# Altium schematic sheet WAB_1_1_top_level.SchDoc: FMC Top Sheet
size A2; DocumentNumber: 1; SheetNumber: 1; SheetTotal: 2
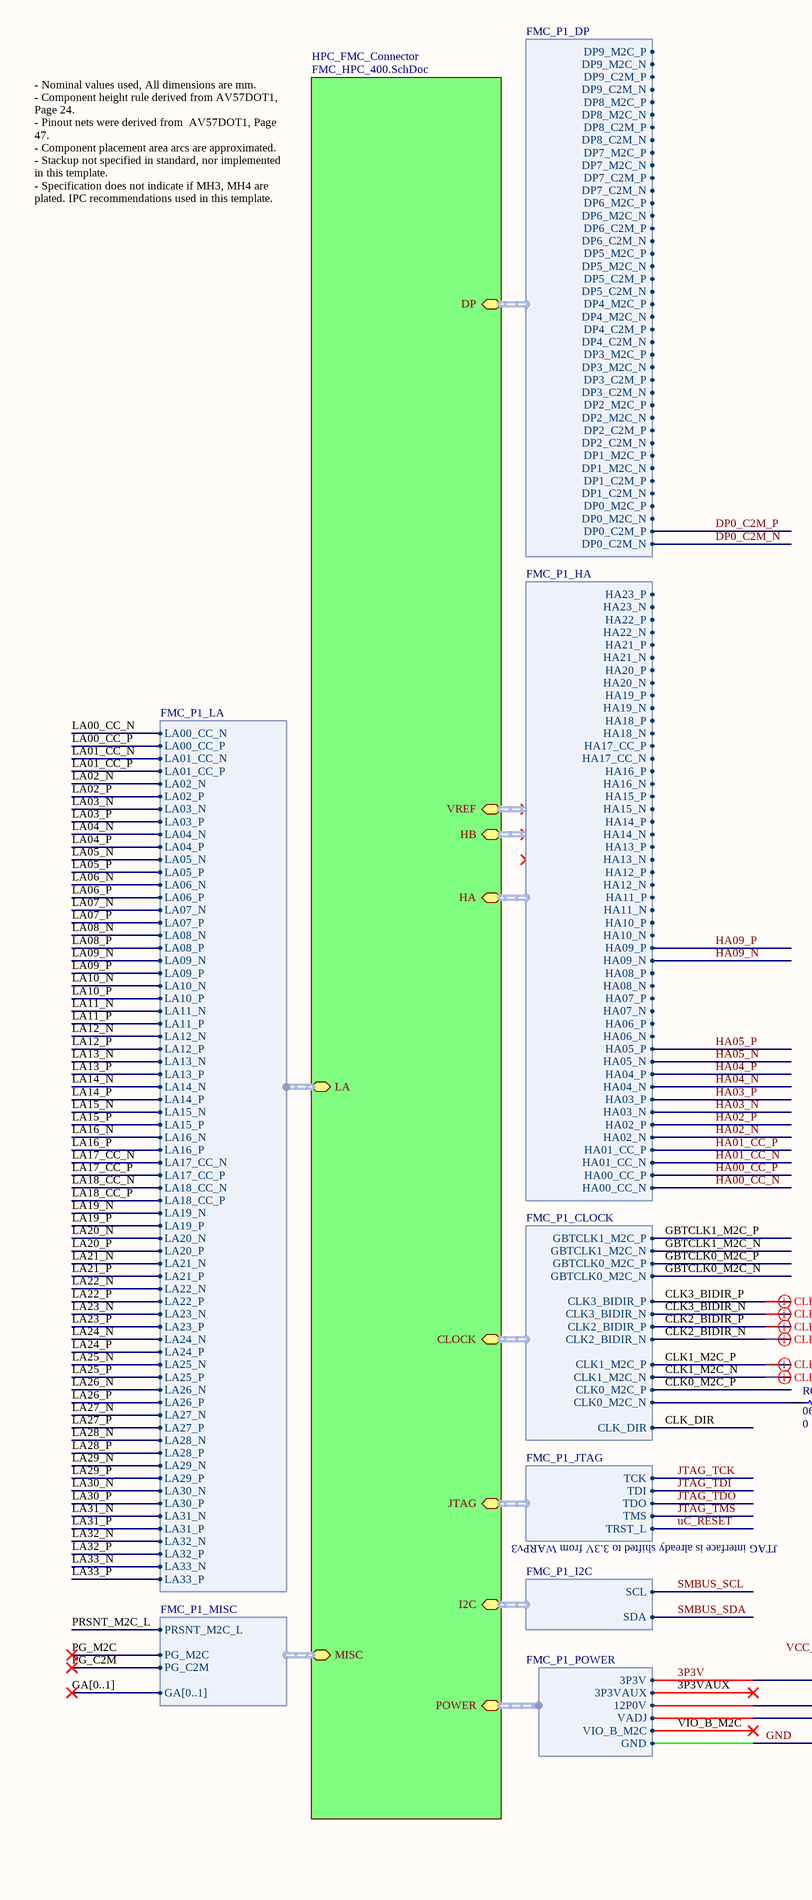
[diagram p0: WAB_1_1_top_level.SchDoc, left]
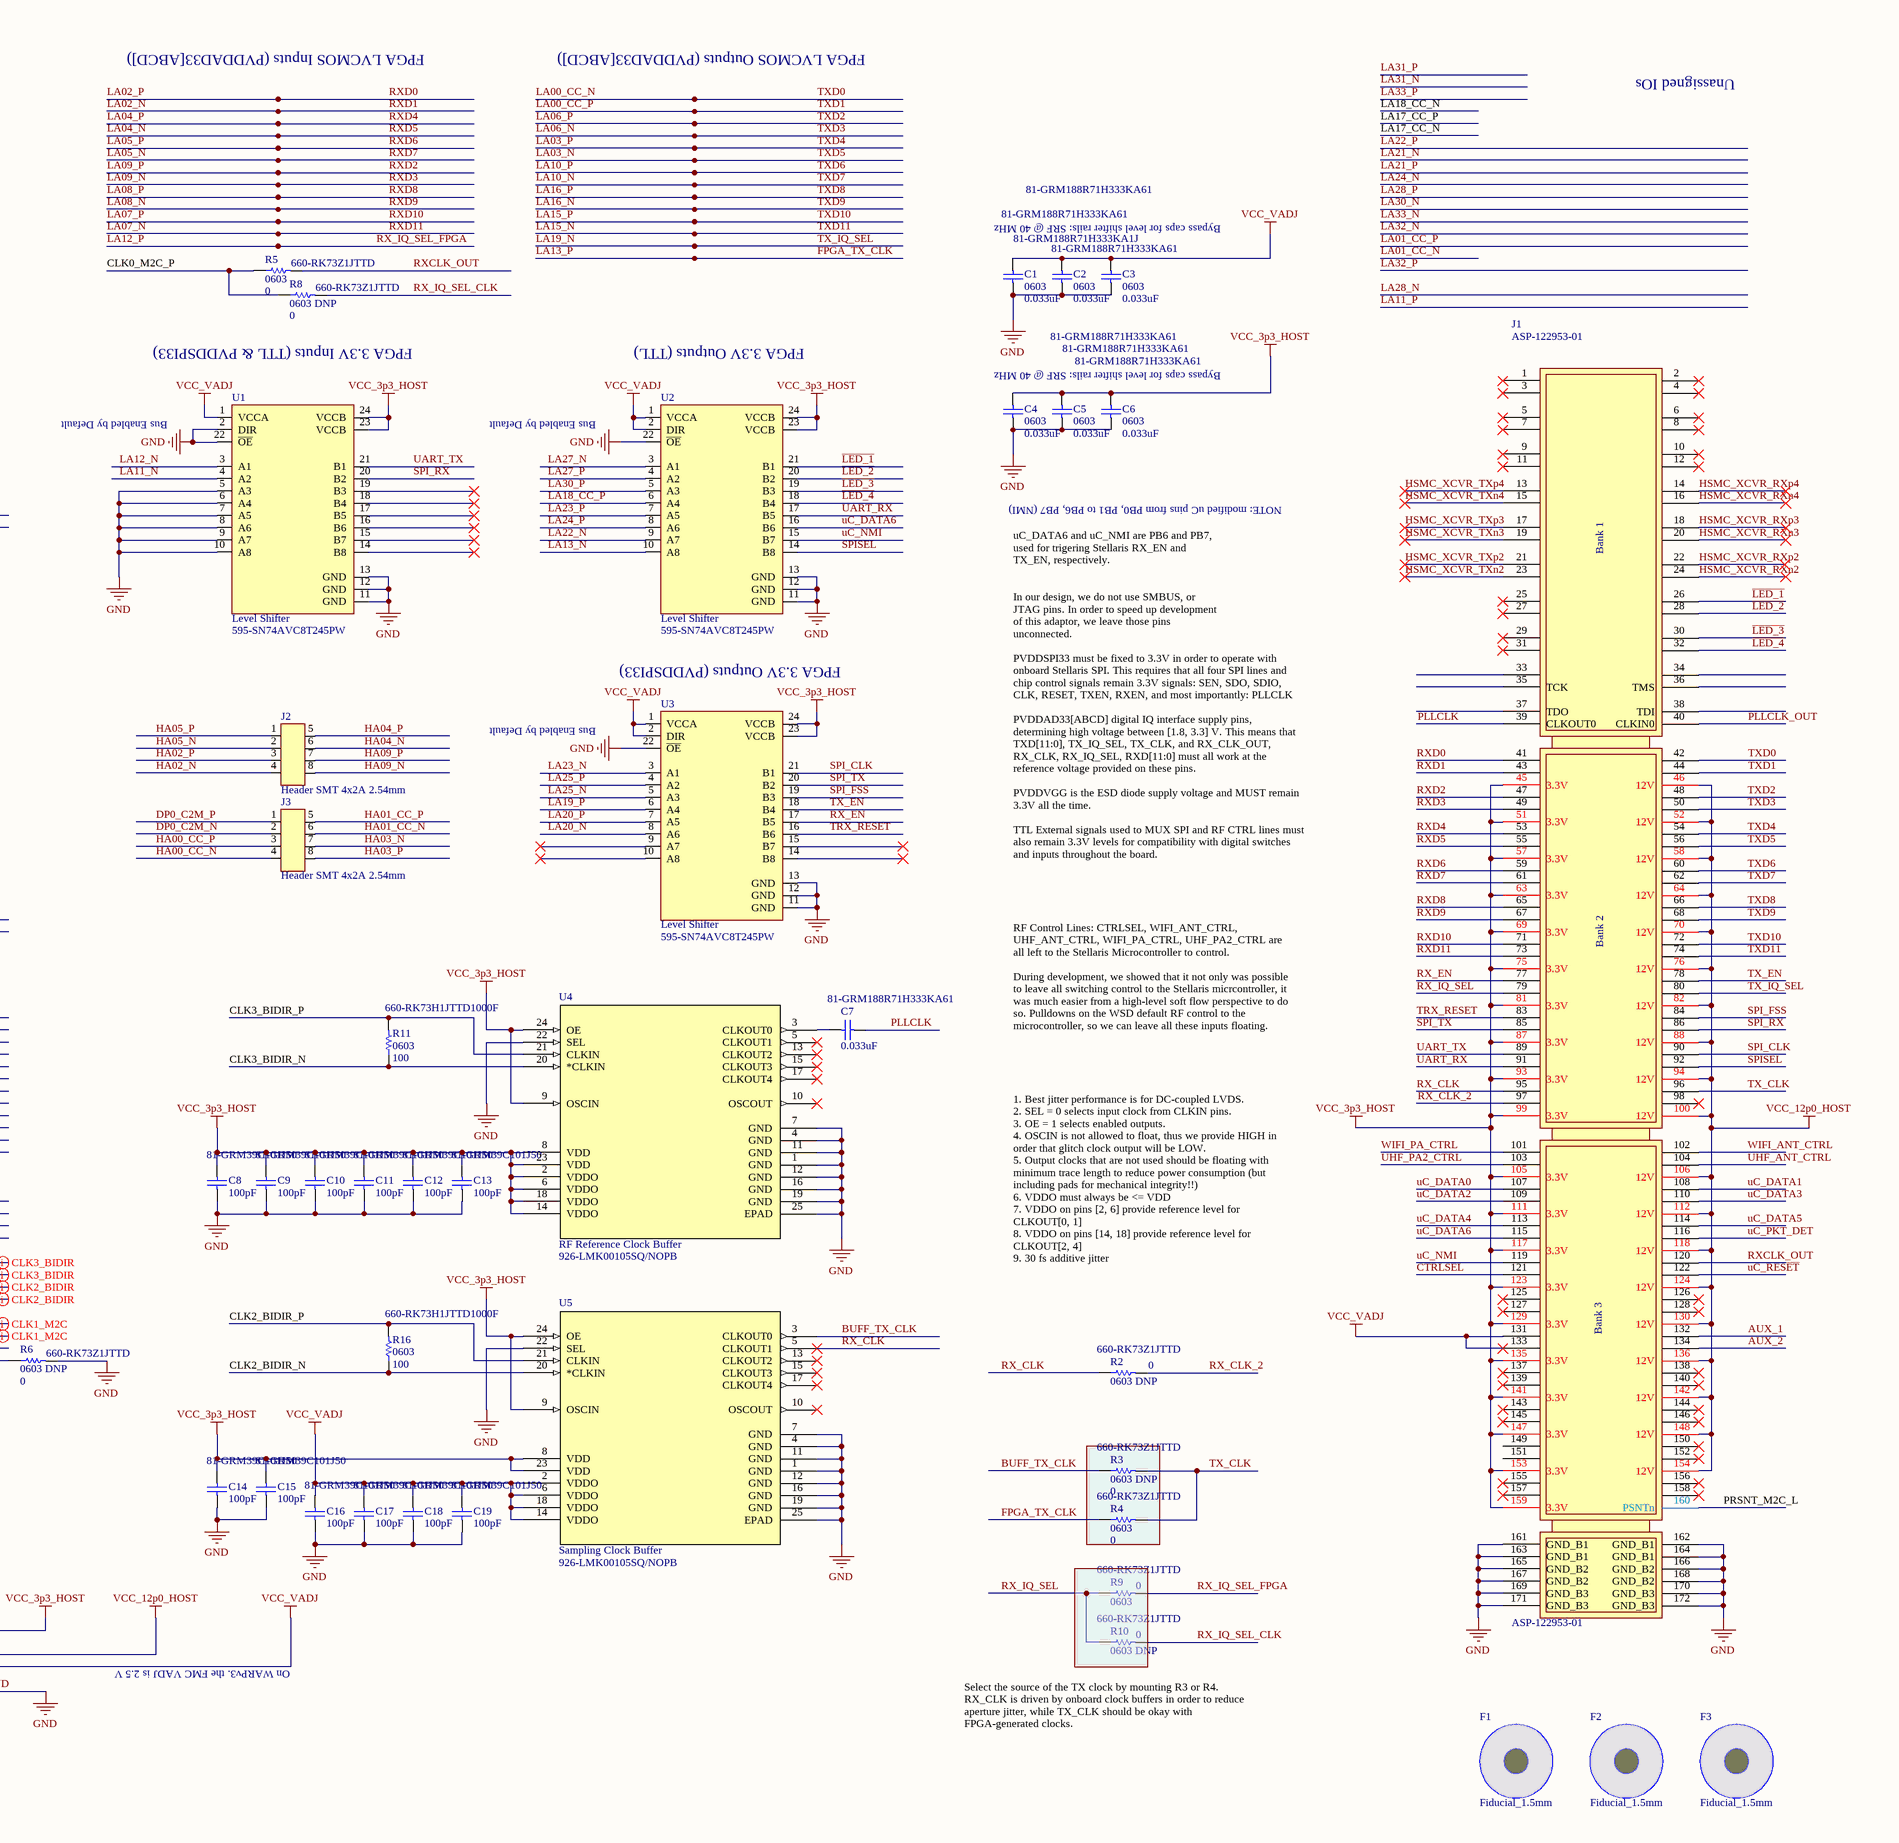
[diagram p1: WAB_1_1_top_level.SchDoc, right]

## Parts
C1  0603  value 0.033uF  Supplier Part Number 1: 81-GRM188R71H333KA1J  Supplier Part Number 2: 81-GRM188R71H333KA61  [0603_SMT_v3]
C2  0603  value 0.033uF  Supplier Part Number 2: 81-GRM188R71H333KA61  [0603_SMT_v3]
C3  0603  value 0.033uF  Supplier Part Number 2: 81-GRM188R71H333KA61  [0603_SMT_v3]
C4  0603  value 0.033uF  Supplier Part Number 2: 81-GRM188R71H333KA61  [0603_SMT_v3]
C5  0603  value 0.033uF  Supplier Part Number 2: 81-GRM188R71H333KA61  [0603_SMT_v3]
C6  0603  value 0.033uF  Supplier Part Number 2: 81-GRM188R71H333KA61  [0603_SMT_v3]
C7  value 0.033uF  Supplier Part Number 1: 81-GRM188R71H333KA61  [0603_SMT_v3]  (hidden comment: 0603)
C8  value 100pF  Supplier Part Number 1: 81-GRM39C101J50  [0603_SMT_v3]  (hidden comment: 0603)
C9  value 100pF  Supplier Part Number 1: 81-GRM39C101J50  [0603_SMT_v3]  (hidden comment: 0603)
C10  value 100pF  Supplier Part Number 1: 81-GRM39C101J50  [0603_SMT_v3]  (hidden comment: 0603)
C11  value 100pF  Supplier Part Number 1: 81-GRM39C101J50  [0603_SMT_v3]  (hidden comment: 0603)
C12  value 100pF  Supplier Part Number 1: 81-GRM39C101J50  [0603_SMT_v3]  (hidden comment: 0603)
C13  value 100pF  Supplier Part Number 1: 81-GRM39C101J50  [0603_SMT_v3]  (hidden comment: 0603)
C14  value 100pF  Supplier Part Number 1: 81-GRM39C101J50  [0603_SMT_v3]  (hidden comment: 0603)
C15  value 100pF  Supplier Part Number 1: 81-GRM39C101J50  [0603_SMT_v3]  (hidden comment: 0603)
C16  value 100pF  Supplier Part Number 1: 81-GRM39C101J50  [0603_SMT_v3]  (hidden comment: 0603)
C17  value 100pF  Supplier Part Number 1: 81-GRM39C101J50  [0603_SMT_v3]  (hidden comment: 0603)
C18  value 100pF  Supplier Part Number 1: 81-GRM39C101J50  [0603_SMT_v3]  (hidden comment: 0603)
C19  value 100pF  Supplier Part Number 1: 81-GRM39C101J50  [0603_SMT_v3]  (hidden comment: 0603)
F1  Fiducial_1.5mm  [1.5mm_FIDUCIAL_v4]
F2  Fiducial_1.5mm  [1.5mm_FIDUCIAL_v4]
F3  Fiducial_1.5mm  [1.5mm_FIDUCIAL_v4]
J1  ASP-122953-01  [ASP-122953-01_v2]
J2  Header SMT 4x2A 2.54mm  [2.54mm_4x2_HDR]
J3  Header SMT 4x2A 2.54mm  [2.54mm_4x2_HDR]
R2  0603 DNP  value 0  Supplier Part Number 1: 660-RK73Z1JTTD  [0603_SMT_v3]
R3  0603 DNP  value 0  Supplier Part Number 1: 660-RK73Z1JTTD  [0603_SMT_v3]
R4  0603  value 0  Supplier Part Number 1: 660-RK73Z1JTTD  [0603_SMT_v3]
R5  0603  value 0  Supplier Part Number 1: 660-RK73Z1JTTD  [0603_SMT_v3]
R6  0603 DNP  value 0  Supplier Part Number 1: 660-RK73Z1JTTD  [0603_SMT_v3]
R8  0603 DNP  value 0  Supplier Part Number 1: 660-RK73Z1JTTD  [0603_SMT_v3]
R9  0603  value 0  Supplier Part Number 1: 660-RK73Z1JTTD  [0603_SMT_v3]
R10  0603 DNP  value 0  Supplier Part Number 1: 660-RK73Z1JTTD  [0603_SMT_v3]
R11  0603  value 100  Supplier Part Number 1: 660-RK73H1JTTD1000F  [0603_SMT_v3]
R16  0603  value 100  Supplier Part Number 1: 660-RK73H1JTTD1000F  [0603_SMT_v3]
U1  Level Shifter  Supplier Part Number 1: 595-SN74AVC8T245PW  [TSSOP-24_TI]
U2  Level Shifter  Supplier Part Number 1: 595-SN74AVC8T245PW  [TSSOP-24_TI]
U3  Level Shifter  Supplier Part Number 1: 595-SN74AVC8T245PW  [TSSOP-24_TI]
U4  RF Reference Clock Buffer  Supplier Part Number 1: 926-LMK00105SQ/NOPB  [RTW24]
U5  Sampling Clock Buffer  Supplier Part Number 1: 926-LMK00105SQ/NOPB  [RTW24]

## Sub-sheets
HPC_FMC_Connector = FMC_HPC_400.SchDoc: LA (harness FMC_P1_LA), MISC (harness FMC_P1_MISC), POWER (harness FMC_P1_POWER), JTAG (harness FMC_P1_JTAG), I2C (harness FMC_P1_I2C), CLOCK (harness FMC_P1_CLOCK), VREF (harness FMC_P1_VREF), HB (harness FMC_P1_HB), DP (harness FMC_P1_DP), HA (harness FMC_P1_HA)

## Harnesses
FMC_P1_MISC: PRSNT_M2C_L, PG_M2C, PG_C2M, GA[0..1]
FMC_P1_JTAG: TCK, TDI, TDO, TMS, TRST_L
FMC_P1_I2C: SCL, SDA
FMC_P1_LA: LA05_N, LA05_P, LA06_N, LA06_P, LA09_N, LA09_P, LA10_N, LA10_P, LA13_N, LA13_P, LA14_N, LA14_P, LA23_N, LA23_P, LA26_N, LA26_P, LA27_N, LA27_P, LA02_N, LA02_P, LA03_N, LA03_P, LA04_N, LA04_P, LA07_N, LA07_P, LA08_N, LA08_P, LA11_N, LA11_P, LA12_N, LA12_P, LA15_N, LA15_P, LA16_N, LA16_P, LA19_N, LA19_P, LA20_N, LA20_P, LA21_N, LA21_P, LA22_N, LA22_P, LA24_N, LA24_P, LA25_N, LA25_P, LA28_N, LA28_P, LA29_N, LA29_P, LA30_N, LA30_P, LA31_N, LA31_P, LA32_N, LA32_P, LA33_N, LA33_P, LA00_CC_N, LA00_CC_P, LA01_CC_N, LA01_CC_P, LA17_CC_N, LA17_CC_P, LA18_CC_N, LA18_CC_P
FMC_P1_CLOCK: CLK2_BIDIR_N, CLK2_BIDIR_P, CLK3_BIDIR_N, CLK3_BIDIR_P, CLK0_M2C_N, CLK0_M2C_P, CLK1_M2C_N, CLK1_M2C_P, CLK_DIR, GBTCLK0_M2C_N, GBTCLK0_M2C_P, GBTCLK1_M2C_N, GBTCLK1_M2C_P
FMC_P1_POWER: 12P0V, 3P3V, 3P3VAUX, GND, VADJ, VIO_B_M2C
FMC_P1_HA: HA00_CC_N, HA00_CC_P, HA01_CC_N, HA01_CC_P, HA02_N, HA02_P, HA03_N, HA03_P, HA04_N, HA04_P, HA05_N, HA05_P, HA06_N, HA06_P, HA07_N, HA07_P, HA08_N, HA08_P, HA09_N, HA09_P, HA10_N, HA10_P, HA11_N, HA11_P, HA12_N, HA12_P, HA13_N, HA13_P, HA14_N, HA14_P, HA15_N, HA15_P, HA16_N, HA16_P, HA17_CC_N, HA17_CC_P, HA18_N, HA18_P, HA19_N, HA19_P, HA20_N, HA20_P, HA21_N, HA21_P, HA22_N, HA22_P, HA23_N, HA23_P
FMC_P1_DP: DP0_C2M_N, DP0_C2M_P, DP0_M2C_N, DP0_M2C_P, DP1_C2M_N, DP1_C2M_P, DP1_M2C_N, DP1_M2C_P, DP2_C2M_N, DP2_C2M_P, DP2_M2C_N, DP2_M2C_P, DP3_C2M_N, DP3_C2M_P, DP3_M2C_N, DP3_M2C_P, DP4_C2M_N, DP4_C2M_P, DP4_M2C_N, DP4_M2C_P, DP5_C2M_N, DP5_C2M_P, DP5_M2C_N, DP5_M2C_P, DP6_C2M_N, DP6_C2M_P, DP6_M2C_N, DP6_M2C_P, DP7_C2M_N, DP7_C2M_P, DP7_M2C_N, DP7_M2C_P, DP8_C2M_N, DP8_C2M_P, DP8_M2C_N, DP8_M2C_P, DP9_C2M_N, DP9_C2M_P, DP9_M2C_N, DP9_M2C_P

## Nets
3P3V: C4.2 C5.2 C6.2 C8.2 C9.2 C10.2 C11.2 C12.2 C13.2 C14.2 C15.2 J1.45(3.3V) J1.51(3.3V) J1.57(3.3V) J1.63(3.3V) J1.69(3.3V) J1.75(3.3V) J1.81(3.3V) J1.87(3.3V) J1.93(3.3V) J1.99(3.3V) J1.105(3.3V) J1.111(3.3V) J1.117(3.3V) J1.123(3.3V) J1.129(3.3V) J1.135(3.3V) J1.141(3.3V) J1.147(3.3V) J1.153(3.3V) J1.159(3.3V) U1.23(VCCB) U1.24(VCCB) U2.23(VCCB) U2.24(VCCB) U3.23(VCCB) U3.24(VCCB) U4.2(VDDO) U4.6(VDDO) U4.8(VDD) U4.9(OSCIN) U4.14(VDDO) U4.18(VDDO) U4.23(VDD) U4.24(OE) U5.8(VDD) U5.9(OSCIN) U5.23(VDD) U5.24(OE) ; sheet HPC_FMC_Connector/POWER.3P3V  [also labelled VCC_3p3_HOST]
GND: C1.1 C2.1 C3.1 C4.1 C5.1 C6.1 C8.1 C9.1 C10.1 C11.1 C12.1 C13.1 C14.1 C15.1 C16.1 C17.1 C18.1 C19.1 J1.161(GND_B1) J1.162(GND_B1) J1.163(GND_B1) J1.164(GND_B1) J1.165(GND_B2) J1.166(GND_B2) J1.167(GND_B2) J1.168(GND_B2) J1.169(GND_B3) J1.170(GND_B3) J1.171(GND_B3) J1.172(GND_B3) R6.2 U1.2(DIR) U1.5(A3) U1.6(A4) U1.7(A5) U1.8(A6) U1.9(A7) U1.10(A8) U1.11(GND) U1.12(GND) U1.13(GND) U1.22(~{OE}) U2.11(GND) U2.12(GND) U2.13(GND) U2.22(~{OE}) U3.11(GND) U3.12(GND) U3.13(GND) U3.22(~{OE}) U4.1(GND) U4.4(GND) U4.7(GND) U4.11(GND) U4.12(GND) U4.16(GND) U4.19(GND) U4.22(SEL) U4.25(EPAD) U5.1(GND) U5.4(GND) U5.7(GND) U5.11(GND) U5.12(GND) U5.16(GND) U5.19(GND) U5.22(SEL) U5.25(EPAD) ; sheet HPC_FMC_Connector/POWER.GND
VCC_12p0_HOST: J1.46(12V) J1.52(12V) J1.58(12V) J1.64(12V) J1.70(12V) J1.76(12V) J1.82(12V) J1.88(12V) J1.94(12V) J1.100(12V) J1.106(12V) J1.112(12V) J1.118(12V) J1.124(12V) J1.130(12V) J1.136(12V) J1.142(12V) J1.148(12V) J1.154(12V) ; sheet HPC_FMC_Connector/POWER.12P0V
VCC_VADJ: C1.2 C2.2 C3.2 C16.2 C17.2 C18.2 C19.2 J1.131 J1.133 U1.1(VCCA) U2.1(VCCA) U2.2(DIR) U3.1(VCCA) U3.2(DIR) U5.2(VDDO) U5.6(VDDO) U5.14(VDDO) U5.18(VDDO) ; sheet HPC_FMC_Connector/POWER.VADJ
3P3VAUX: sheet HPC_FMC_Connector/POWER.3P3VAUX
~{LED_1}: J1.26 U2.21(B1)
~{LED_2}: J1.28 U2.20(B2)
~{LED_3}: J1.30 U2.19(B3)
~{LED_4}: J1.32 U2.18(B4)
~{uC_RESET}: J1.122 ; sheet HPC_FMC_Connector/JTAG.TRST_L
AUX_1: J1.132
AUX_2: J1.134
BUFF_TX_CLK: R3.1 U5.3(CLKOUT0)
CLK0_M2C_P: R5.1 R8.1 ; sheet HPC_FMC_Connector/CLOCK.CLK0_M2C_P
CLK1_M2C_N: sheet HPC_FMC_Connector/CLOCK.CLK1_M2C_N
CLK1_M2C_P: sheet HPC_FMC_Connector/CLOCK.CLK1_M2C_P
CLK2_BIDIR_N: R16.1 U5.20(*CLKIN) ; sheet HPC_FMC_Connector/CLOCK.CLK2_BIDIR_N
CLK2_BIDIR_P: R16.2 U5.21(CLKIN) ; sheet HPC_FMC_Connector/CLOCK.CLK2_BIDIR_P
CLK3_BIDIR_N: R11.1 U4.20(*CLKIN) ; sheet HPC_FMC_Connector/CLOCK.CLK3_BIDIR_N
CLK3_BIDIR_P: R11.2 U4.21(CLKIN) ; sheet HPC_FMC_Connector/CLOCK.CLK3_BIDIR_P
CLK_DIR: sheet HPC_FMC_Connector/CLOCK.CLK_DIR
CTRLSEL: J1.121
DP0_C2M_N: J3.2 ; sheet HPC_FMC_Connector/DP.DP0_C2M_N
DP0_C2M_P: J3.1 ; sheet HPC_FMC_Connector/DP.DP0_C2M_P
FPGA_TX_CLK: R4.1 ; sheet HPC_FMC_Connector/LA.LA13_P  [also labelled LA13_P]
GBTCLK0_M2C_N: sheet HPC_FMC_Connector/CLOCK.GBTCLK0_M2C_N
GBTCLK0_M2C_P: sheet HPC_FMC_Connector/CLOCK.GBTCLK0_M2C_P
GBTCLK1_M2C_N: sheet HPC_FMC_Connector/CLOCK.GBTCLK1_M2C_N
GBTCLK1_M2C_P: sheet HPC_FMC_Connector/CLOCK.GBTCLK1_M2C_P
HA00_CC_N: J3.4 ; sheet HPC_FMC_Connector/HA.HA00_CC_N
HA00_CC_P: J3.3 ; sheet HPC_FMC_Connector/HA.HA00_CC_P
HA01_CC_N: J3.6 ; sheet HPC_FMC_Connector/HA.HA01_CC_N
HA01_CC_P: J3.5 ; sheet HPC_FMC_Connector/HA.HA01_CC_P
HA02_N: J2.4 ; sheet HPC_FMC_Connector/HA.HA02_N
HA02_P: J2.3 ; sheet HPC_FMC_Connector/HA.HA02_P
HA03_N: J3.7 ; sheet HPC_FMC_Connector/HA.HA03_N
HA03_P: J3.8 ; sheet HPC_FMC_Connector/HA.HA03_P
HA04_N: J2.6 ; sheet HPC_FMC_Connector/HA.HA04_N
HA04_P: J2.5 ; sheet HPC_FMC_Connector/HA.HA04_P
HA05_N: J2.2 ; sheet HPC_FMC_Connector/HA.HA05_N
HA05_P: J2.1 ; sheet HPC_FMC_Connector/HA.HA05_P
HA09_N: J2.8 ; sheet HPC_FMC_Connector/HA.HA09_N
HA09_P: J2.7 ; sheet HPC_FMC_Connector/HA.HA09_P
HSMC_XCVR_RXn2: J1.24
HSMC_XCVR_RXn3: J1.20
HSMC_XCVR_RXn4: J1.16
HSMC_XCVR_RXp2: J1.22
HSMC_XCVR_RXp3: J1.18
HSMC_XCVR_RXp4: J1.14
HSMC_XCVR_TXn2: J1.23
HSMC_XCVR_TXn3: J1.19
HSMC_XCVR_TXn4: J1.15
HSMC_XCVR_TXp2: J1.21
HSMC_XCVR_TXp3: J1.17
HSMC_XCVR_TXp4: J1.13
JTAG_TCK: sheet HPC_FMC_Connector/JTAG.TCK
JTAG_TDI: sheet HPC_FMC_Connector/JTAG.TDI
JTAG_TDO: sheet HPC_FMC_Connector/JTAG.TDO
JTAG_TMS: sheet HPC_FMC_Connector/JTAG.TMS
LA00_CC_N: J1.42 ; sheet HPC_FMC_Connector/LA.LA00_CC_N  [also labelled TXD0]
LA00_CC_P: J1.44 ; sheet HPC_FMC_Connector/LA.LA00_CC_P  [also labelled TXD1]
LA01_CC_N: sheet HPC_FMC_Connector/LA.LA01_CC_N
LA01_CC_P: sheet HPC_FMC_Connector/LA.LA01_CC_P
LA02_N: J1.43 ; sheet HPC_FMC_Connector/LA.LA02_N  [also labelled RXD1]
LA02_P: J1.41 ; sheet HPC_FMC_Connector/LA.LA02_P  [also labelled RXD0]
LA03_N: J1.56 ; sheet HPC_FMC_Connector/LA.LA03_N  [also labelled TXD5]
LA03_P: J1.54 ; sheet HPC_FMC_Connector/LA.LA03_P  [also labelled TXD4]
LA04_N: J1.55 ; sheet HPC_FMC_Connector/LA.LA04_N  [also labelled RXD5]
LA04_P: J1.53 ; sheet HPC_FMC_Connector/LA.LA04_P  [also labelled RXD4]
LA05_N: J1.61 ; sheet HPC_FMC_Connector/LA.LA05_N  [also labelled RXD7]
LA05_P: J1.59 ; sheet HPC_FMC_Connector/LA.LA05_P  [also labelled RXD6]
LA06_N: J1.50 ; sheet HPC_FMC_Connector/LA.LA06_N  [also labelled TXD3]
LA06_P: J1.48 ; sheet HPC_FMC_Connector/LA.LA06_P  [also labelled TXD2]
LA07_N: J1.73 ; sheet HPC_FMC_Connector/LA.LA07_N  [also labelled RXD11]
LA07_P: J1.71 ; sheet HPC_FMC_Connector/LA.LA07_P  [also labelled RXD10]
LA08_N: J1.67 ; sheet HPC_FMC_Connector/LA.LA08_N  [also labelled RXD9]
LA08_P: J1.65 ; sheet HPC_FMC_Connector/LA.LA08_P  [also labelled RXD8]
LA09_N: J1.49 ; sheet HPC_FMC_Connector/LA.LA09_N  [also labelled RXD3]
LA09_P: J1.47 ; sheet HPC_FMC_Connector/LA.LA09_P  [also labelled RXD2]
LA10_N: J1.62 ; sheet HPC_FMC_Connector/LA.LA10_N  [also labelled TXD7]
LA10_P: J1.60 ; sheet HPC_FMC_Connector/LA.LA10_P  [also labelled TXD6]
LA11_N: U1.4(A2) ; sheet HPC_FMC_Connector/LA.LA11_N
LA11_P: sheet HPC_FMC_Connector/LA.LA11_P
LA12_N: U1.3(A1) ; sheet HPC_FMC_Connector/LA.LA12_N
LA12_P: R9.2 ; sheet HPC_FMC_Connector/LA.LA12_P  [also labelled RX_IQ_SEL_FPGA]
LA13_N: U2.10(A8) ; sheet HPC_FMC_Connector/LA.LA13_N
LA14_N: sheet HPC_FMC_Connector/LA.LA14_N
LA14_P: sheet HPC_FMC_Connector/LA.LA14_P
LA15_N: J1.74 ; sheet HPC_FMC_Connector/LA.LA15_N  [also labelled TXD11]
LA15_P: J1.72 ; sheet HPC_FMC_Connector/LA.LA15_P  [also labelled TXD10]
LA16_N: J1.68 ; sheet HPC_FMC_Connector/LA.LA16_N  [also labelled TXD9]
LA16_P: J1.66 ; sheet HPC_FMC_Connector/LA.LA16_P  [also labelled TXD8]
LA17_CC_N: sheet HPC_FMC_Connector/LA.LA17_CC_N
LA17_CC_P: sheet HPC_FMC_Connector/LA.LA17_CC_P
LA18_CC_N: sheet HPC_FMC_Connector/LA.LA18_CC_N
LA18_CC_P: U2.6(A4) ; sheet HPC_FMC_Connector/LA.LA18_CC_P
LA19_N: J1.80 ; sheet HPC_FMC_Connector/LA.LA19_N  [also labelled TX_IQ_SEL]
LA19_P: U3.6(A4) ; sheet HPC_FMC_Connector/LA.LA19_P
LA20_N: U3.8(A6) ; sheet HPC_FMC_Connector/LA.LA20_N
LA20_P: U3.7(A5) ; sheet HPC_FMC_Connector/LA.LA20_P
LA21_N: sheet HPC_FMC_Connector/LA.LA21_N
LA21_P: sheet HPC_FMC_Connector/LA.LA21_P
LA22_N: U2.9(A7) ; sheet HPC_FMC_Connector/LA.LA22_N
LA22_P: sheet HPC_FMC_Connector/LA.LA22_P
LA23_N: U3.3(A1) ; sheet HPC_FMC_Connector/LA.LA23_N
LA23_P: U2.7(A5) ; sheet HPC_FMC_Connector/LA.LA23_P
LA24_N: sheet HPC_FMC_Connector/LA.LA24_N
LA24_P: U2.8(A6) ; sheet HPC_FMC_Connector/LA.LA24_P
LA25_N: U3.5(A3) ; sheet HPC_FMC_Connector/LA.LA25_N
LA25_P: U3.4(A2) ; sheet HPC_FMC_Connector/LA.LA25_P
LA26_N: sheet HPC_FMC_Connector/LA.LA26_N
LA26_P: sheet HPC_FMC_Connector/LA.LA26_P
LA27_N: U2.3(A1) ; sheet HPC_FMC_Connector/LA.LA27_N
LA27_P: U2.4(A2) ; sheet HPC_FMC_Connector/LA.LA27_P
LA28_N: sheet HPC_FMC_Connector/LA.LA28_N
LA28_P: sheet HPC_FMC_Connector/LA.LA28_P
LA29_N: sheet HPC_FMC_Connector/LA.LA29_N
LA29_P: sheet HPC_FMC_Connector/LA.LA29_P
LA30_N: sheet HPC_FMC_Connector/LA.LA30_N
LA30_P: U2.5(A3) ; sheet HPC_FMC_Connector/LA.LA30_P
LA31_N: sheet HPC_FMC_Connector/LA.LA31_N
LA31_P: sheet HPC_FMC_Connector/LA.LA31_P
LA32_N: sheet HPC_FMC_Connector/LA.LA32_N
LA32_P: sheet HPC_FMC_Connector/LA.LA32_P
LA33_N: sheet HPC_FMC_Connector/LA.LA33_N
LA33_P: sheet HPC_FMC_Connector/LA.LA33_P
PG_C2M: sheet HPC_FMC_Connector/MISC.PG_C2M
PG_M2C: sheet HPC_FMC_Connector/MISC.PG_M2C
PLLCLK: C7.1 J1.39(CLKOUT0)
PLLCLK_OUT: J1.40(CLKIN0)
PRSNT_M2C_L: J1.160(PSNTn) ; sheet HPC_FMC_Connector/MISC.PRSNT_M2C_L
RX_CLK: J1.95 R2.1 U5.5(CLKOUT1)
RX_CLK_2: J1.97 R2.2
RX_EN: J1.77 U3.17(B5)
RX_IQ_SEL: J1.79 R9.1 R10.1
RX_IQ_SEL_CLK: R8.2 R10.2
RXCLK_OUT: J1.120 R5.2
SMBUS_SCL: sheet HPC_FMC_Connector/I2C.SCL
SMBUS_SDA: sheet HPC_FMC_Connector/I2C.SDA
SPI_CLK: J1.90 U3.21(B1)
SPI_FSS: J1.84 U3.19(B3)
SPI_RX: J1.86 U1.20(B2)
SPI_TX: J1.85 U3.20(B2)
SPISEL: J1.92 U2.14(B8)
TRX_RESET: J1.83 U3.16(B6)
TX_CLK: J1.96 R3.2 R4.2
TX_EN: J1.78 U3.18(B4)
UART_RX: J1.91 U2.17(B5)
UART_TX: J1.89 U1.21(B1)
uC_DATA0: J1.107
uC_DATA1: J1.108
uC_DATA2: J1.109
uC_DATA3: J1.110
uC_DATA4: J1.113
uC_DATA5: J1.114
uC_DATA6: J1.115 U2.16(B6)
uC_NMI: J1.119 U2.15(B7)
uC_PKT_DET: J1.116
UHF_ANT_CTRL: J1.104
UHF_PA2_CTRL: J1.103
VIO_B_M2C: sheet HPC_FMC_Connector/POWER.VIO_B_M2C
WIFI_ANT_CTRL: J1.102
WIFI_PA_CTRL: J1.101
NetC7_2: C7.2 U4.3(CLKOUT0)
NetR6_1: R6.1 ; sheet HPC_FMC_Connector/CLOCK.CLK0_M2C_N

Not connected (* = marked no-connect by the designer): J1 1* 2* 3* 4* 5* 6* 7* 8* 9* 10* 11* 12* 25* 27* 29* 31* 33(SDA) 34(SCL) 35(TCK) 36(TMS) 37(TDO) 38(TDI) 98* 125* 126* 127* 128* 137* 138* 139* 140* 143* 144* 145* 146* 149 150* 151 152* 155* 156* 157* 158*; U1 14(B8)* 15(B7)* 16(B6)* 17(B5)* 18(B4)* 19(B3)*; U3 9(A7)* 10(A8)* 14(B8)* 15(B7)*; U4 5(CLKOUT1)* 10(OSCOUT)* 13(CLKOUT2)* 15(CLKOUT3)* 17(CLKOUT4)*; U5 10(OSCOUT)* 13(CLKOUT2)* 15(CLKOUT3)* 17(CLKOUT4)*

## Buses and harness runs
bus GA[0..1]

## Layout directives
differential pair: CLK1_M2C_N, CLK1_M2C_P, CLK2_BIDIR_N, CLK2_BIDIR_P, CLK3_BIDIR_N, CLK3_BIDIR_P

## Notes on the sheet
- FPGA LVCMOS Inputs (PVDDAD33[ABCD])
- FPGA LVCMOS Outputs (PVDDAD33[ABCD])
- Unassigned IOs
- Bypass caps for level shifter rails: SRF @ 40 MHz
- - Nominal values used, All dimensions are mm.
  - Component height rule derived from AV57DOT1, Page 24.
  - Pinout nets were derived from  AV57DOT1, Page 47.
  - Component placement area arcs are approximated.
  - Stackup not specified in standard, nor implemented in this template.
  - Specification does not indicate if MH3, MH4 are plated. IPC recommendations used in this template.
- FPGA 3.3V Inputs (TTL & PVDDSPI33)
- FPGA 3.3V Outputs (TTL)
- Bus Enabled by Default
- NOTE: modified uC pins from PB0, PB1 to PB6, PB7 (NMI)
- uC_DATA6 and uC_NMI are PB6 and PB7, used for trigering Stellaris RX_EN and TX_EN, respectively.
- FPGA 3.3V Outputs (PVDDSPI33)
- In our design, we do not use SMBUS, or JTAG pins. In order to speed up development of this adaptor, we leave those pins unconnected.
- PVDDSPI33 must be fixed to 3.3V in order to operate with onboard Stellaris SPI. This requires that all four SPI lines and chip control signals remain 3.3V signals: SEN, SDO, SDIO, CLK, RESET, TXEN, RXEN, and most importantly: PLLCLK
  PVDDAD33[ABCD] digital IQ interface supply pins, determining high voltage between [1.8, 3.3] V. This means that TXD[11:0], TX_IQ_SEL, TX_CLK, and RX_CLK_OUT, RX_CLK, RX_IQ_SEL, RXD[11:0] must all work at the reference voltage provided on these pins.
  PVDDVGG is the ESD diode supply voltage and MUST remain 3.3V all the time.
  TTL External signals used to MUX SPI and RF CTRL lines must also remain 3.3V levels for compatibility with digital switches and inputs throughout the board.
- RF Control Lines: CTRLSEL, WIFI_ANT_CTRL, UHF_ANT_CTRL, WIFI_PA_CTRL, UHF_PA2_CTRL are all left to the Stellaris Microcontroller to control.
  During development, we showed that it not only was possible to leave all switching control to the Stellaris micrcontroller, it was much easier from a high-level soft flow perspective to do so. Pulldowns on the WSD default RF control to the microcontroller, so we can leave all these inputs floating.
- 1. Best jitter performance is for DC-coupled LVDS.
  2. SEL = 0 selects input clock from CLKIN pins.
  3. OE = 1 selects enabled outputs.
  4. OSCIN is not allowed to float, thus we provide HIGH in order that glitch clock output will be LOW.
  5. Output clocks that are not used should be floating with minimum trace length to reduce power consumption (but including pads for mechanical integrity!!)
  6. VDDO must always be <= VDD
  7. VDDO on pins [2, 6] provide reference level for
  CLKOUT[0, 1]
  8. VDDO on pins [14, 18] provide reference level for
  CLKOUT[2, 4]
  9. 30 fs additive jitter
- JTAG interface is already shifted to 3.3V from WARPv3
- On WARPv3. the FMC VADJ is 2.5 V
- (near R10) Select the source of the TX clock by mounting R3 or R4. RX_CLK is driven by onboard clock buffers in order to reduce aperture jitter, while TX_CLK should be okay with FPGA-generated clocks.
- Sheet Title
- Project Title
- Size:
- Date:
- A3
- Item:
- Time:
- Revision:
- Sheet
- of
- File:
- (in symbol ASP-122953-01) Bank 1; Bank 2; Bank 3

## Library data of the parts
C1-C6 = Cap Semi: Capacitor (Semiconductor SIM Model); Published: 8-Jun-2000; LatestRevisionDate: 29-May-2009; LatestRevisionNote: IPC-7351 Footprint Added.; PackageReference: C1206; Publisher: Altium Limited; PackageDescription: Chip Capacitor; Supplier 1: Mouser; Supplier 2: Mouser
  C2-C6: Supplier Part Number 1: 81-GRM188R71H333KA1J
C7-C19 = Cap_0603: Supplier 1: Mouser
J1 = ASP-122953-01: Samtec HSMC Host Connector (Female)
R2-R6 R8-R11 R16 = Res_0603: 0603 SMT Resistor; Supplier 1: Mouser
U1-U3 = SN74AVC8T245PW: 8-bit Dual Supply Bus Transceiver; Supplier 1: Mouser
U4 U5 = LMK00105_RTW_24: TI Universal-to-CMOS 5-Output Clock Buffer; Vendor: TEXAS INSTRUMENTS; Manufacturer_Part_Number: lmk00105_rtw_24; RefDes: RefDes; Type: DEV; Value: Value; Supplier 1: Mouser